# Altium project LimeMM-X8-FMC_1v0.PrjPcb (part 7 of 7)
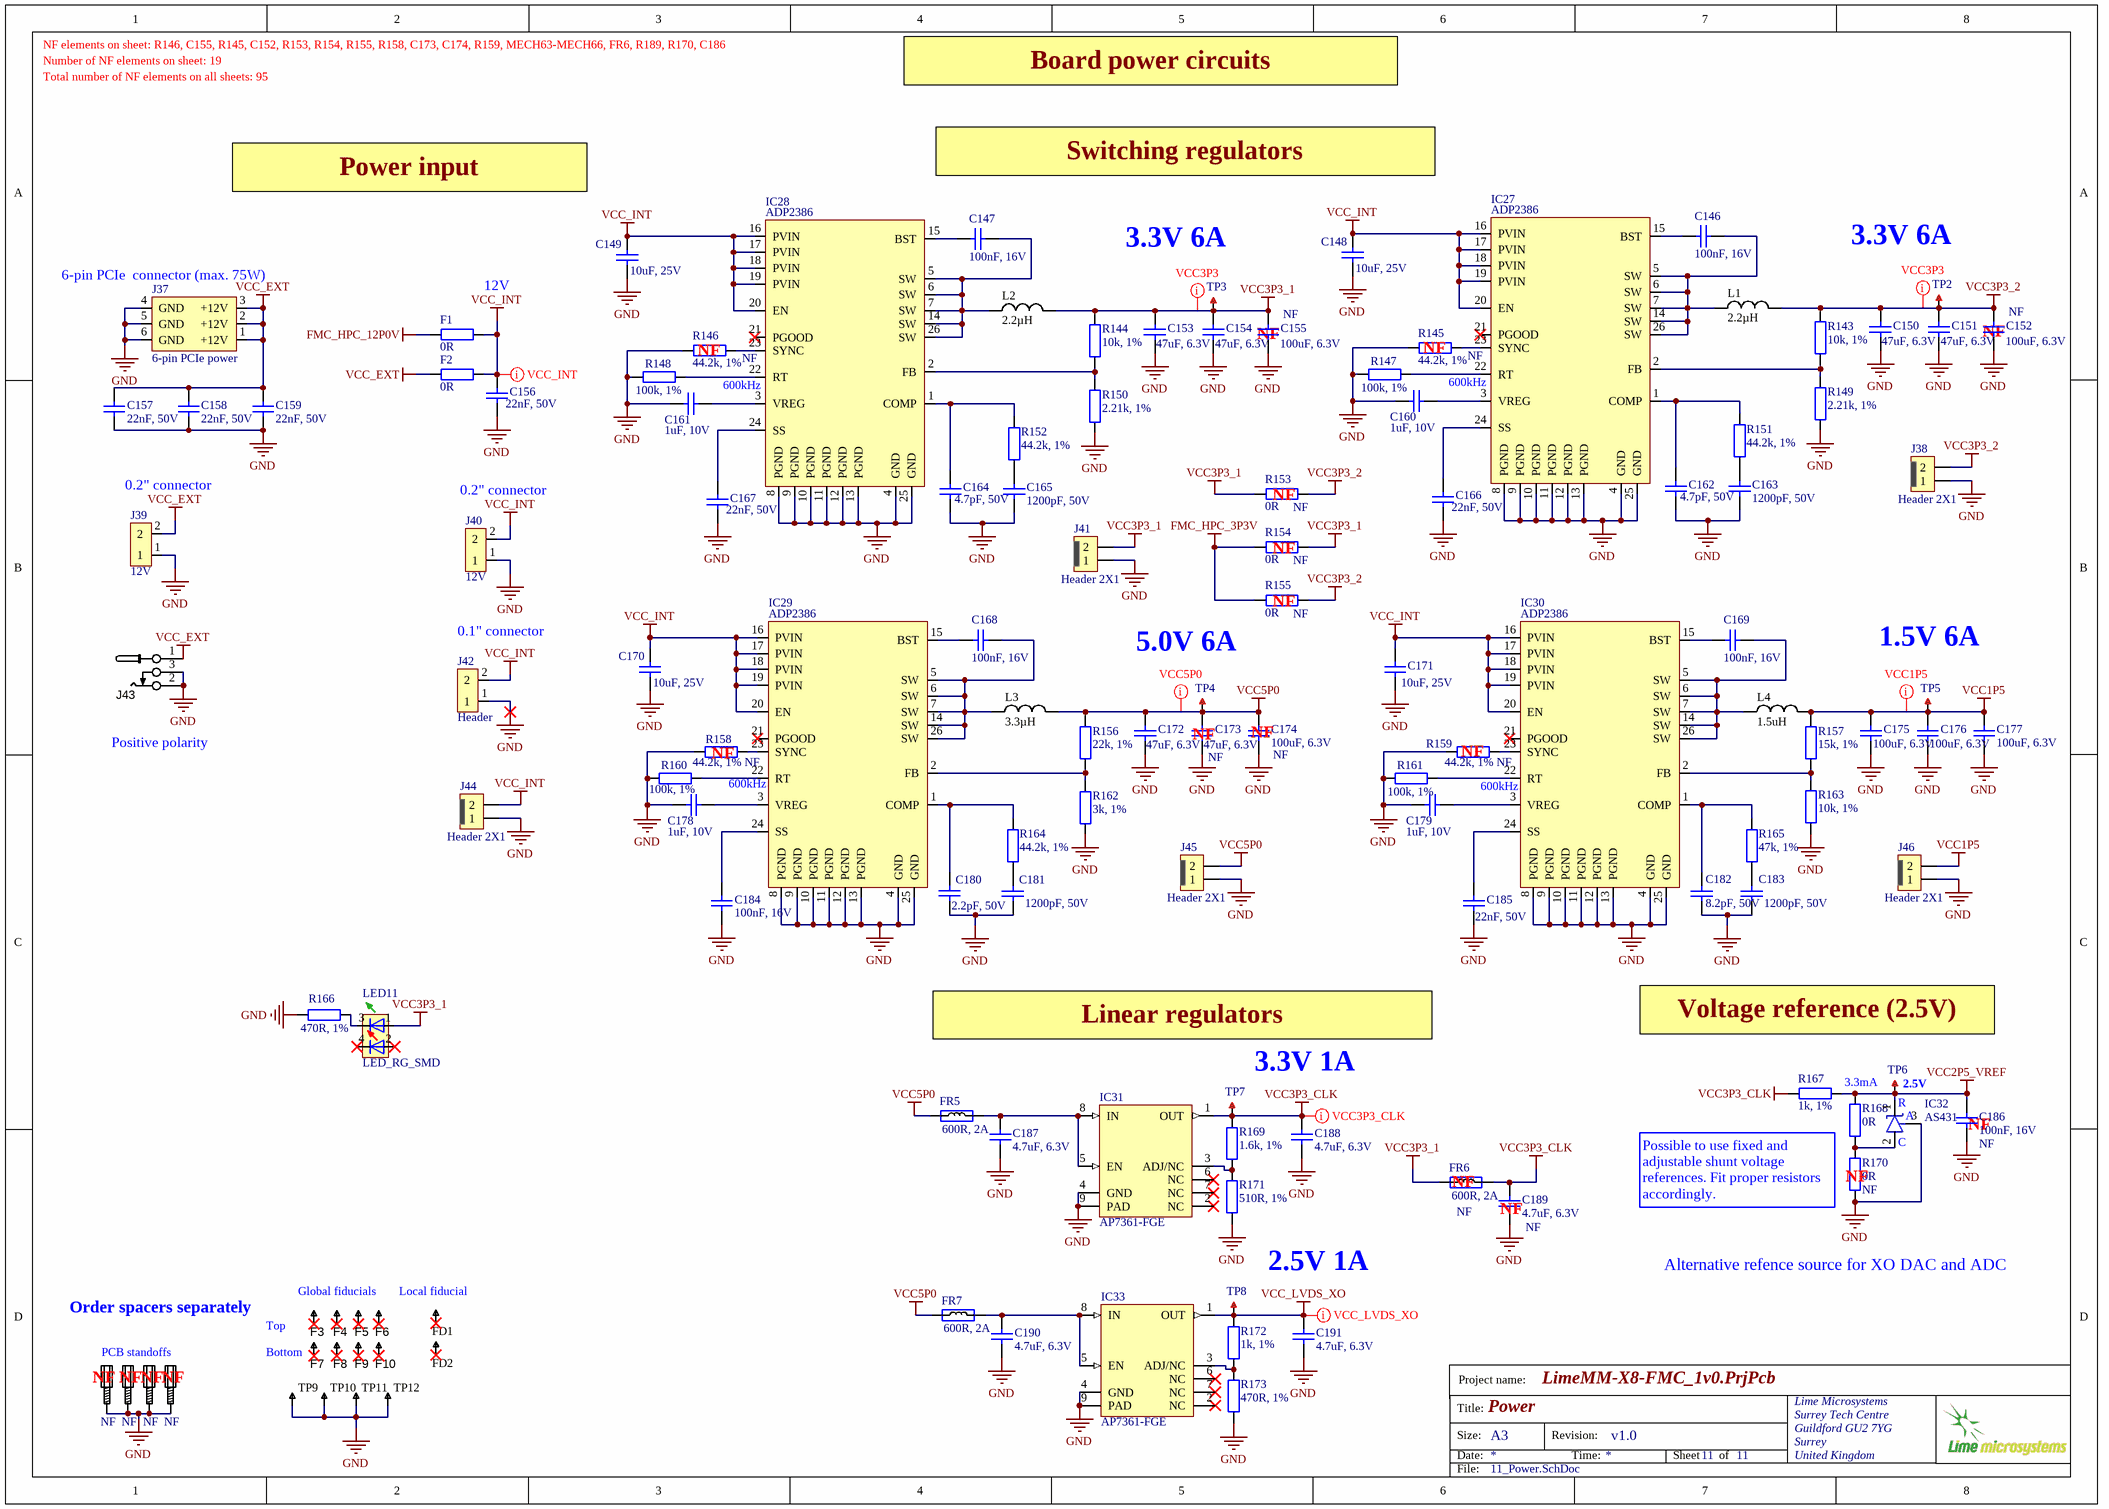
[diagram p12: 11_Power.SchDoc]

## Nets that join several sheets
FMC_HPC_3P3V: 04_FMC_HPC0 (J1.C39 J1.D36 J1.D38 J1.D40), 05_FMC_HPC1 (J2.C39 J2.D36 J2.D38 J2.D40), 11_Power (R154.2 R155.2)
FMC_HPC_3P3VAUX: 04_FMC_HPC0 (5 pins), 05_FMC_HPC1 (6 pins)
FMC_HPC_12P0V: 04_FMC_HPC0 (J1.C35 J1.C37), 05_FMC_HPC1 (J2.C35 J2.C37), 11_Power (F1.2)
FMC_HPC_VADJ: 04_FMC_HPC0 (J1.E39 J1.F40 J1.G39 J1.H40), 05_FMC_HPC1 (J2.E39 J2.F40 J2.G39 J2.H40), 08_Level_conv_misc (38 pins)
GND: 04_FMC_HPC0 (188 pins), 05_FMC_HPC1 (165 pins), 06_mPCIe_1-4 (72 pins), 07_mPCIe_5-8 (72 pins), 08_Level_conv_misc (92 pins), 09_Clock_RF_ref (77 pins), 10_Clock_data_ref (39 pins), 11_Power (116 pins)
VCC1P5: 06_mPCIe_1-4 (12 pins), 07_mPCIe_5-8 (12 pins), 11_Power (7 pins)
VCC2P5_VREF: 09_Clock_RF_ref (R97.2), 11_Power (5 pins)
VCC3P3_1: 04_FMC_HPC0 (26 pins), 06_mPCIe_1-4 (24 pins), 08_Level_conv_misc (46 pins), 11_Power (11 pins)
VCC3P3_2: 07_mPCIe_5-8 (24 pins), 08_Level_conv_misc (R74.1), 11_Power (9 pins)
VCC3P3_CLK: 09_Clock_RF_ref (12 pins), 10_Clock_data_ref (40 pins), 11_Power (7 pins)
VCC5P0: 08_Level_conv_misc (R71.1), 11_Power (9 pins)
VCC_INT: 08_Level_conv_misc (R68.1), 11_Power (30 pins)
VCC_LVDS_XO: 10_Clock_data_ref (R136.2), 11_Power (C191.2 IC33.1 R172.2 TP8.1)
ADF_MUXOUT: 08_Level_conv_misc (IC10.18), 09_Clock_RF_ref (IC21.15 R105.2 R112.1)
ADF_MUXOUT_LS: 04_FMC_HPC0 (J1.H23), 08_Level_conv_misc (IC10.6)
FAN_CTRL_LS: 05_FMC_HPC1 (J2.C18), 08_Level_conv_misc (IC12.3)
FMC_HPC0_CLK_N: 04_FMC_HPC0 (J1.G3), 10_Clock_data_ref (R135.2)
FMC_HPC0_CLK_P: 04_FMC_HPC0 (J1.G2), 10_Clock_data_ref (R131.2)
FMC_HPC0_GBTCLK0_M2C_N: 04_FMC_HPC0 (J1.D5), 10_Clock_data_ref (IC23.21)
FMC_HPC0_GBTCLK0_M2C_P: 04_FMC_HPC0 (J1.D4), 10_Clock_data_ref (IC23.22)
FMC_HPC0_GBTCLK1_M2C_N: 04_FMC_HPC0 (J1.B21), 10_Clock_data_ref (IC23.10)
FMC_HPC0_GBTCLK1_M2C_P: 04_FMC_HPC0 (J1.B20), 10_Clock_data_ref (IC23.11)
FMC_HPC0_LA11_N: 04_FMC_HPC0 (J1.H17), 08_Level_conv_misc (J27.2)
FMC_HPC0_LA15_N: 04_FMC_HPC0 (J1.H20), 08_Level_conv_misc (J27.9)
FMC_HPC0_LA15_P: 04_FMC_HPC0 (J1.H19), 08_Level_conv_misc (J27.10)
FMC_HPC0_LA16_P: 04_FMC_HPC0 (J1.G18), 08_Level_conv_misc (J27.3)
FMC_HPC0_TDI: 04_FMC_HPC0 (J1.D30 R4.2), 06_mPCIe_1-4 (J5.1 R12.2 X1.2)
FMC_HPC0_TDO: 04_FMC_HPC0 (J1.D31 R4.1), 07_mPCIe_5-8 (J24.2 R31.1 X8.1)
FMC_HPC1_GBTCLK0_M2C_N: 05_FMC_HPC1 (J2.D5), 10_Clock_data_ref (IC26.26)
FMC_HPC1_GBTCLK0_M2C_P: 05_FMC_HPC1 (J2.D4), 10_Clock_data_ref (IC26.27)
FMC_HPC1_LA00_CC_N: 05_FMC_HPC1 (J2.G7), 08_Level_conv_misc (J27.5)
FMC_HPC1_LA00_CC_P: 05_FMC_HPC1 (J2.G6), 08_Level_conv_misc (J27.7)
FMC_HPC1_LA02_N: 05_FMC_HPC1 (J2.H8), 08_Level_conv_misc (J27.8)
FMC_HPC1_LA04_N: 05_FMC_HPC1 (J2.H11), 08_Level_conv_misc (J27.4)
FMC_HPC1_LA04_P: 05_FMC_HPC1 (J2.H10), 08_Level_conv_misc (J27.6)
FMC_HPC1_LA11_P: 05_FMC_HPC1 (J2.H16), 08_Level_conv_misc (J27.1)
FPGA_I2C0_SCL: 08_Level_conv_misc (R61.2 VT1.D), 10_Clock_data_ref (IC24.4 XO6.8)
FPGA_I2C0_SCL_LS: 05_FMC_HPC1 (J2.D8), 08_Level_conv_misc (R60.2 VT1.S)
FPGA_I2C0_SDA: 08_Level_conv_misc (R67.2 VT2.D), 10_Clock_data_ref (IC24.5 XO6.7)
FPGA_I2C0_SDA_LS: 05_FMC_HPC1 (J2.G12), 08_Level_conv_misc (R66.2 VT2.S)
FPGA_SPI0_ADF_SS: 08_Level_conv_misc (IC12.19), 09_Clock_RF_ref (R111.1)
FPGA_SPI0_ADF_SS_LS: 05_FMC_HPC1 (J2.D17), 08_Level_conv_misc (IC12.5)
FPGA_SPI0_DAC_SS: 08_Level_conv_misc (IC12.20), 09_Clock_RF_ref (R114.2)
FPGA_SPI0_DAC_SS_LS: 05_FMC_HPC1 (J2.C19), 08_Level_conv_misc (IC12.4)
FPGA_SPI0_MOSI: 08_Level_conv_misc (IC12.18), 09_Clock_RF_ref (R110.1 R116.2)
FPGA_SPI0_MOSI_LS: 05_FMC_HPC1 (J2.D18), 08_Level_conv_misc (IC12.6)
FPGA_SPI0_SCLK: 08_Level_conv_misc (IC12.17), 09_Clock_RF_ref (R108.1 R115.2)
FPGA_SPI0_SCLK_LS: 05_FMC_HPC1 (J2.G16), 08_Level_conv_misc (IC12.7)
PCIE1_CLK_IN: 06_mPCIe_1-4 (J3.19), 09_Clock_RF_ref (IC18.1)
PCIE1_CLK_REQ: 06_mPCIe_1-4 (J3.7), 08_Level_conv_misc (IC9.14 R45.1)
PCIE1_CLK_REQ_LS: 04_FMC_HPC0 (J1.H32), 08_Level_conv_misc (IC9.10)
PCIE1_COEX1: 06_mPCIe_1-4 (J3.3), 08_Level_conv_misc (IC7.20)
PCIE1_COEX1_LS: 04_FMC_HPC0 (J1.G34), 08_Level_conv_misc (IC7.4)
PCIE1_COEX2: 06_mPCIe_1-4 (J3.5), 08_Level_conv_misc (IC9.15)
PCIE1_COEX2_LS: 04_FMC_HPC0 (J1.H31), 08_Level_conv_misc (IC9.9)
PCIE1_LED_WLAN: 06_mPCIe_1-4 (J3.44), 08_Level_conv_misc (IC11.15)
PCIE1_LED_WLAN_LS: 04_FMC_HPC0 (J1.D12), 08_Level_conv_misc (IC11.9)
PCIE1_LED_WPAN: 06_mPCIe_1-4 (J3.46), 08_Level_conv_misc (IC9.20)
PCIE1_LED_WPAN_LS: 04_FMC_HPC0 (J1.C27), 08_Level_conv_misc (IC9.4)
PCIE1_LED_WWAN: 06_mPCIe_1-4 (J3.42), 08_Level_conv_misc (IC11.21)
PCIE1_LED_WWAN_LS: 04_FMC_HPC0 (J1.G12), 08_Level_conv_misc (IC11.3)
PCIE1_PERST: 06_mPCIe_1-4 (J3.22), 08_Level_conv_misc (IC7.18)
PCIE1_PERST_LS: 04_FMC_HPC0 (J1.H35), 08_Level_conv_misc (IC7.6)
PCIE1_REF_CLK_N: 06_mPCIe_1-4 (J3.11), 10_Clock_data_ref (IC23.30)
PCIE1_REF_CLK_P: 06_mPCIe_1-4 (J3.13), 10_Clock_data_ref (IC23.31)
PCIE1_RX0_N: 04_FMC_HPC0 (J1.C3), 06_mPCIe_1-4 (J3.31)
PCIE1_RX0_P: 04_FMC_HPC0 (J1.C2), 06_mPCIe_1-4 (J3.33)
PCIE1_RX1_N: 04_FMC_HPC0 (J1.A23), 06_mPCIe_1-4 (J3.47)
PCIE1_RX1_P: 04_FMC_HPC0 (J1.A22), 06_mPCIe_1-4 (J3.49)
PCIE1_TCK: 04_FMC_HPC0 (IC2.19), 06_mPCIe_1-4 (X1.5)
PCIE1_TMS: 04_FMC_HPC0 (IC4.21), 06_mPCIe_1-4 (X1.3)
PCIE1_TX0_N: 04_FMC_HPC0 (J1.C7), 06_mPCIe_1-4 (C12.1)
PCIE1_TX0_P: 04_FMC_HPC0 (J1.C6), 06_mPCIe_1-4 (C14.1)
PCIE1_TX1_N: 04_FMC_HPC0 (J1.A3), 06_mPCIe_1-4 (C16.1)
PCIE1_TX1_P: 04_FMC_HPC0 (J1.A2), 06_mPCIe_1-4 (C18.1)
PCIE1_UIM8: 06_mPCIe_1-4 (J3.17), 08_Level_conv_misc (IC9.21)
PCIE1_UIM8_LS: 04_FMC_HPC0 (J1.C26), 08_Level_conv_misc (IC9.3)
PCIE1_W_DISABLE: 06_mPCIe_1-4 (J3.20), 08_Level_conv_misc (IC7.19)
PCIE1_W_DISABLE_LS: 04_FMC_HPC0 (J1.H34), 08_Level_conv_misc (IC7.5)
PCIE2_CLK_IN: 06_mPCIe_1-4 (J4.19), 09_Clock_RF_ref (IC18.3)
PCIE2_CLK_REQ: 06_mPCIe_1-4 (J4.7), 08_Level_conv_misc (IC9.18 R46.1)
PCIE2_CLK_REQ_LS: 04_FMC_HPC0 (J1.D27), 08_Level_conv_misc (IC9.6)
PCIE2_COEX1: 06_mPCIe_1-4 (J4.3), 08_Level_conv_misc (IC11.18)
PCIE2_COEX1_LS: 04_FMC_HPC0 (J1.C11), 08_Level_conv_misc (IC11.6)
PCIE2_COEX2: 06_mPCIe_1-4 (J4.5), 08_Level_conv_misc (IC9.19)
PCIE2_COEX2_LS: 04_FMC_HPC0 (J1.D26), 08_Level_conv_misc (IC9.5)
PCIE2_LED_WLAN: 06_mPCIe_1-4 (J4.44), 08_Level_conv_misc (IC11.20)
PCIE2_LED_WLAN_LS: 04_FMC_HPC0 (J1.G13), 08_Level_conv_misc (IC11.4)
PCIE2_LED_WPAN: 06_mPCIe_1-4 (J4.46), 08_Level_conv_misc (IC9.16)
PCIE2_LED_WPAN_LS: 04_FMC_HPC0 (J1.G28), 08_Level_conv_misc (IC9.8)
PCIE2_LED_WWAN: 06_mPCIe_1-4 (J4.42), 08_Level_conv_misc (IC11.17)
PCIE2_LED_WWAN_LS: 04_FMC_HPC0 (J1.D11), 08_Level_conv_misc (IC11.7)
PCIE2_PERST: 06_mPCIe_1-4 (J4.22), 08_Level_conv_misc (IC11.16)
PCIE2_PERST_LS: 04_FMC_HPC0 (J1.H14), 08_Level_conv_misc (IC11.8)
PCIE2_REF_CLK_N: 06_mPCIe_1-4 (J4.11), 10_Clock_data_ref (IC23.28)
PCIE2_REF_CLK_P: 06_mPCIe_1-4 (J4.13), 10_Clock_data_ref (IC23.29)
PCIE2_RX0_N: 04_FMC_HPC0 (J1.A27), 06_mPCIe_1-4 (J4.31)
PCIE2_RX0_P: 04_FMC_HPC0 (J1.A26), 06_mPCIe_1-4 (J4.33)
PCIE2_TCK: 04_FMC_HPC0 (IC2.20), 06_mPCIe_1-4 (X2.5)
PCIE2_TMS: 04_FMC_HPC0 (IC4.20), 06_mPCIe_1-4 (X2.3)
PCIE2_TX0_N: 04_FMC_HPC0 (J1.A7), 06_mPCIe_1-4 (C13.1)
PCIE2_TX0_P: 04_FMC_HPC0 (J1.A6), 06_mPCIe_1-4 (C15.1)
PCIE2_UIM8: 06_mPCIe_1-4 (J4.17), 08_Level_conv_misc (IC9.17)
PCIE2_UIM8_LS: 04_FMC_HPC0 (J1.G27), 08_Level_conv_misc (IC9.7)
PCIE2_W_DISABLE: 06_mPCIe_1-4 (J4.20), 08_Level_conv_misc (IC11.19)
PCIE2_W_DISABLE_LS: 04_FMC_HPC0 (J1.C10), 08_Level_conv_misc (IC11.5)
PCIE3_CLK_IN: 06_mPCIe_1-4 (J9.19), 09_Clock_RF_ref (IC18.5)
PCIE3_CLK_REQ: 06_mPCIe_1-4 (J9.7), 08_Level_conv_misc (IC13.14 R54.1)
PCIE3_CLK_REQ_LS: 04_FMC_HPC0 (J1.H29), 08_Level_conv_misc (IC13.10)
PCIE3_COEX1: 06_mPCIe_1-4 (J9.3), 08_Level_conv_misc (IC11.14)
PCIE3_COEX1_LS: 04_FMC_HPC0 (J1.D15), 08_Level_conv_misc (IC11.10)
PCIE3_COEX2: 06_mPCIe_1-4 (J9.5), 08_Level_conv_misc (IC13.15)
PCIE3_COEX2_LS: 04_FMC_HPC0 (J1.H28), 08_Level_conv_misc (IC13.9)
PCIE3_LED_WLAN: 06_mPCIe_1-4 (J9.44), 08_Level_conv_misc (IC14.15)
PCIE3_LED_WLAN_LS: 04_FMC_HPC0 (J1.D20), 08_Level_conv_misc (IC14.9)
PCIE3_LED_WPAN: 06_mPCIe_1-4 (J9.46), 08_Level_conv_misc (IC13.17)
PCIE3_LED_WPAN_LS: 04_FMC_HPC0 (J1.D24), 08_Level_conv_misc (IC13.7)
PCIE3_LED_WWAN: 06_mPCIe_1-4 (J9.42), 08_Level_conv_misc (IC14.19)
PCIE3_LED_WWAN_LS: 04_FMC_HPC0 (J1.C14), 08_Level_conv_misc (IC14.5)
PCIE3_PERST: 06_mPCIe_1-4 (J9.22), 08_Level_conv_misc (IC14.18)
PCIE3_PERST_LS: 04_FMC_HPC0 (J1.C15), 08_Level_conv_misc (IC14.6)
PCIE3_REF_CLK_N: 06_mPCIe_1-4 (J9.11), 10_Clock_data_ref (IC23.26)
PCIE3_REF_CLK_P: 06_mPCIe_1-4 (J9.13), 10_Clock_data_ref (IC23.27)
PCIE3_RX0_N: 04_FMC_HPC0 (J1.A31), 06_mPCIe_1-4 (J9.31)
PCIE3_RX0_P: 04_FMC_HPC0 (J1.A30), 06_mPCIe_1-4 (J9.33)
PCIE3_TCK: 04_FMC_HPC0 (IC2.21), 06_mPCIe_1-4 (X3.5)
PCIE3_TMS: 04_FMC_HPC0 (IC4.19), 06_mPCIe_1-4 (X3.3)
PCIE3_TX0_N: 04_FMC_HPC0 (J1.A11), 06_mPCIe_1-4 (C20.1)
PCIE3_TX0_P: 04_FMC_HPC0 (J1.A10), 06_mPCIe_1-4 (C22.1)
PCIE3_UIM8: 06_mPCIe_1-4 (J9.17), 08_Level_conv_misc (IC13.19)
PCIE3_UIM8_LS: 04_FMC_HPC0 (J1.D23), 08_Level_conv_misc (IC13.5)
PCIE3_W_DISABLE: 06_mPCIe_1-4 (J9.20), 08_Level_conv_misc (IC14.21)
PCIE3_W_DISABLE_LS: 04_FMC_HPC0 (J1.D14), 08_Level_conv_misc (IC14.3)
PCIE4_CLK_IN: 06_mPCIe_1-4 (J10.19), 09_Clock_RF_ref (IC18.7)
PCIE4_CLK_REQ: 06_mPCIe_1-4 (J10.7), 08_Level_conv_misc (IC13.16 R55.1)
PCIE4_CLK_REQ_LS: 04_FMC_HPC0 (J1.G25), 08_Level_conv_misc (IC13.8)
PCIE4_COEX1: 06_mPCIe_1-4 (J10.3), 08_Level_conv_misc (IC14.17)
PCIE4_COEX1_LS: 04_FMC_HPC0 (J1.G16), 08_Level_conv_misc (IC14.7)
PCIE4_COEX2: 06_mPCIe_1-4 (J10.5), 08_Level_conv_misc (IC13.18)
PCIE4_COEX2_LS: 04_FMC_HPC0 (J1.G24), 08_Level_conv_misc (IC13.6)
PCIE4_LED_WLAN: 06_mPCIe_1-4 (J10.44), 08_Level_conv_misc (IC8.21)
PCIE4_LED_WLAN_LS: 05_FMC_HPC1 (J2.H7), 08_Level_conv_misc (IC8.3)
PCIE4_LED_WPAN: 06_mPCIe_1-4 (J10.46), 08_Level_conv_misc (IC13.20)
PCIE4_LED_WPAN_LS: 04_FMC_HPC0 (J1.H26), 08_Level_conv_misc (IC13.4)
PCIE4_LED_WWAN: 06_mPCIe_1-4 (J10.42), 08_Level_conv_misc (IC14.16)
PCIE4_LED_WWAN_LS: 04_FMC_HPC0 (J1.D17), 08_Level_conv_misc (IC14.8)
PCIE4_PERST: 06_mPCIe_1-4 (J10.22), 08_Level_conv_misc (IC14.14)
PCIE4_PERST_LS: 04_FMC_HPC0 (J1.D21), 08_Level_conv_misc (IC14.10)
PCIE4_REF_CLK_N: 06_mPCIe_1-4 (J10.11), 10_Clock_data_ref (IC23.23)
PCIE4_REF_CLK_P: 06_mPCIe_1-4 (J10.13), 10_Clock_data_ref (IC23.24)
PCIE4_RX0_N: 04_FMC_HPC0 (J1.A35), 06_mPCIe_1-4 (J10.31)
PCIE4_RX0_P: 04_FMC_HPC0 (J1.A34), 06_mPCIe_1-4 (J10.33)
PCIE4_TCK: 04_FMC_HPC0 (IC2.18), 06_mPCIe_1-4 (X4.5)
PCIE4_TDO_PCIE5_TDI: 06_mPCIe_1-4 (J12.2 R19.1 X4.1), 07_mPCIe_5-8 (J17.1 R24.2 X5.2)
PCIE4_TMS: 04_FMC_HPC0 (IC4.18), 06_mPCIe_1-4 (X4.3)
PCIE4_TX0_N: 04_FMC_HPC0 (J1.A15), 06_mPCIe_1-4 (C21.1)
PCIE4_TX0_P: 04_FMC_HPC0 (J1.A14), 06_mPCIe_1-4 (C23.1)
PCIE4_UIM8: 06_mPCIe_1-4 (J10.17), 08_Level_conv_misc (IC13.21)
PCIE4_UIM8_LS: 04_FMC_HPC0 (J1.H25), 08_Level_conv_misc (IC13.3)
PCIE4_W_DISABLE: 06_mPCIe_1-4 (J10.20), 08_Level_conv_misc (IC14.20)
PCIE4_W_DISABLE_LS: 04_FMC_HPC0 (J1.G15), 08_Level_conv_misc (IC14.4)
PCIE5_CLK_IN: 07_mPCIe_5-8 (J15.19), 09_Clock_RF_ref (IC18.8)
PCIE5_CLK_REQ: 07_mPCIe_5-8 (J15.7), 08_Level_conv_misc (IC15.14 R56.1)
PCIE5_CLK_REQ_LS: 04_FMC_HPC0 (J1.D9), 08_Level_conv_misc (IC15.10)
PCIE5_COEX1: 07_mPCIe_5-8 (J15.3), 08_Level_conv_misc (IC7.17)
PCIE5_COEX1_LS: 04_FMC_HPC0 (J1.G36), 08_Level_conv_misc (IC7.7)
PCIE5_COEX2: 07_mPCIe_5-8 (J15.5), 08_Level_conv_misc (IC15.19)
PCIE5_COEX2_LS: 04_FMC_HPC0 (J1.G9), 08_Level_conv_misc (IC15.5)
PCIE5_LED_WLAN: 07_mPCIe_5-8 (J15.44), 08_Level_conv_misc (IC7.21)
PCIE5_LED_WLAN_LS: 04_FMC_HPC0 (J1.G33), 08_Level_conv_misc (IC7.3)
PCIE5_LED_WPAN: 07_mPCIe_5-8 (J15.46), 08_Level_conv_misc (IC15.20)
PCIE5_LED_WPAN_LS: 04_FMC_HPC0 (J1.G7), 08_Level_conv_misc (IC15.4)
PCIE5_LED_WWAN: 07_mPCIe_5-8 (J15.42), 08_Level_conv_misc (IC7.14)
PCIE5_LED_WWAN_LS: 04_FMC_HPC0 (J1.H38), 08_Level_conv_misc (IC7.10)
PCIE5_PERST: 07_mPCIe_5-8 (J15.22), 08_Level_conv_misc (IC7.15)
PCIE5_PERST_LS: 04_FMC_HPC0 (J1.H37), 08_Level_conv_misc (IC7.9)
PCIE5_REF_CLK_N: 07_mPCIe_5-8 (J15.11), 10_Clock_data_ref (IC23.14)
PCIE5_REF_CLK_P: 07_mPCIe_5-8 (J15.13), 10_Clock_data_ref (IC23.15)
PCIE5_RX0_N: 04_FMC_HPC0 (J1.A39), 07_mPCIe_5-8 (J15.31)
PCIE5_RX0_P: 04_FMC_HPC0 (J1.A38), 07_mPCIe_5-8 (J15.33)
PCIE5_TCK: 04_FMC_HPC0 (IC2.17), 07_mPCIe_5-8 (X5.5)
PCIE5_TMS: 04_FMC_HPC0 (IC4.17), 07_mPCIe_5-8 (X5.3)
PCIE5_TX0_N: 04_FMC_HPC0 (J1.A19), 07_mPCIe_5-8 (C28.1)
PCIE5_TX0_P: 04_FMC_HPC0 (J1.A18), 07_mPCIe_5-8 (C30.1)
PCIE5_UIM8: 07_mPCIe_5-8 (J15.17), 08_Level_conv_misc (IC15.15)
PCIE5_UIM8_LS: 04_FMC_HPC0 (J1.D8), 08_Level_conv_misc (IC15.9)
PCIE5_W_DISABLE: 07_mPCIe_5-8 (J15.20), 08_Level_conv_misc (IC7.16)
PCIE5_W_DISABLE_LS: 04_FMC_HPC0 (J1.G37), 08_Level_conv_misc (IC7.8)
PCIE6_CLK_IN: 07_mPCIe_5-8 (J16.19), 09_Clock_RF_ref (IC18.17)
PCIE6_CLK_REQ: 07_mPCIe_5-8 (J16.7), 08_Level_conv_misc (IC15.18 R57.1)
PCIE6_CLK_REQ_LS: 04_FMC_HPC0 (J1.G10), 08_Level_conv_misc (IC15.6)
PCIE6_COEX1: 07_mPCIe_5-8 (J16.3), 08_Level_conv_misc (IC8.17)
PCIE6_COEX1_LS: 05_FMC_HPC1 (J2.G10), 08_Level_conv_misc (IC8.7)
PCIE6_COEX2: 07_mPCIe_5-8 (J16.5), 08_Level_conv_misc (IC15.21)
PCIE6_COEX2_LS: 04_FMC_HPC0 (J1.G6), 08_Level_conv_misc (IC15.3)
PCIE6_LED_WLAN: 07_mPCIe_5-8 (J16.44), 08_Level_conv_misc (IC8.14)
PCIE6_LED_WLAN_LS: 05_FMC_HPC1 (J2.D12), 08_Level_conv_misc (IC8.10)
PCIE6_LED_WPAN: 07_mPCIe_5-8 (J16.46), 08_Level_conv_misc (IC15.16)
PCIE6_LED_WPAN_LS: 04_FMC_HPC0 (J1.H13), 08_Level_conv_misc (IC15.8)
PCIE6_LED_WWAN: 07_mPCIe_5-8 (J16.42), 08_Level_conv_misc (IC8.19)
PCIE6_LED_WWAN_LS: 05_FMC_HPC1 (J2.D9), 08_Level_conv_misc (IC8.5)
PCIE6_PERST: 07_mPCIe_5-8 (J16.22), 08_Level_conv_misc (IC8.15)
PCIE6_PERST_LS: 05_FMC_HPC1 (J2.D11), 08_Level_conv_misc (IC8.9)
PCIE6_REF_CLK_N: 07_mPCIe_5-8 (J16.11), 10_Clock_data_ref (IC23.17)
PCIE6_REF_CLK_P: 07_mPCIe_5-8 (J16.13), 10_Clock_data_ref (IC23.18)
PCIE6_RX0_N: 04_FMC_HPC0 (J1.B37), 07_mPCIe_5-8 (J16.31)
PCIE6_RX0_P: 04_FMC_HPC0 (J1.B36), 07_mPCIe_5-8 (J16.33)
PCIE6_TCK: 04_FMC_HPC0 (IC2.16), 07_mPCIe_5-8 (X6.5)
PCIE6_TMS: 04_FMC_HPC0 (IC4.16), 07_mPCIe_5-8 (X6.3)
PCIE6_TX0_N: 04_FMC_HPC0 (J1.B17), 07_mPCIe_5-8 (C29.1)
PCIE6_TX0_P: 04_FMC_HPC0 (J1.B16), 07_mPCIe_5-8 (C31.1)
PCIE6_UIM8: 07_mPCIe_5-8 (J16.17), 08_Level_conv_misc (IC15.17)
PCIE6_UIM8_LS: 04_FMC_HPC0 (J1.H11), 08_Level_conv_misc (IC15.7)
PCIE6_W_DISABLE: 07_mPCIe_5-8 (J16.20), 08_Level_conv_misc (IC8.20)
PCIE6_W_DISABLE_LS: 05_FMC_HPC1 (J2.G9), 08_Level_conv_misc (IC8.4)
PCIE7_CLK_IN: 07_mPCIe_5-8 (J21.19), 09_Clock_RF_ref (IC18.18)
PCIE7_CLK_REQ: 07_mPCIe_5-8 (J21.7), 08_Level_conv_misc (IC17.15 R58.1)
PCIE7_CLK_REQ_LS: 04_FMC_HPC0 (J1.H7), 08_Level_conv_misc (IC17.9)
PCIE7_COEX1: 07_mPCIe_5-8 (J21.3), 08_Level_conv_misc (IC8.16)
PCIE7_COEX1_LS: 05_FMC_HPC1 (J2.C11), 08_Level_conv_misc (IC8.8)
PCIE7_COEX2: 07_mPCIe_5-8 (J21.5), 08_Level_conv_misc (IC17.16)
PCIE7_COEX2_LS: 04_FMC_HPC0 (J1.H8), 08_Level_conv_misc (IC17.8)
PCIE7_LED_WLAN: 07_mPCIe_5-8 (J21.44), 08_Level_conv_misc (IC16.21)
PCIE7_LED_WLAN_LS: 05_FMC_HPC1 (J2.G13), 08_Level_conv_misc (IC16.3)
PCIE7_LED_WPAN: 07_mPCIe_5-8 (J21.46), 08_Level_conv_misc (IC17.17)
PCIE7_LED_WPAN_LS: 04_FMC_HPC0 (J1.H16), 08_Level_conv_misc (IC17.7)
PCIE7_LED_WWAN: 07_mPCIe_5-8 (J21.42), 08_Level_conv_misc (IC16.17)
PCIE7_LED_WWAN_LS: 05_FMC_HPC1 (J2.H13), 08_Level_conv_misc (IC16.7)
PCIE7_PERST: 07_mPCIe_5-8 (J21.22), 08_Level_conv_misc (IC16.14)
PCIE7_PERST_LS: 05_FMC_HPC1 (J2.H14), 08_Level_conv_misc (IC16.10)
PCIE7_REF_CLK_N: 07_mPCIe_5-8 (J21.11), 10_Clock_data_ref (IC23.19)
PCIE7_REF_CLK_P: 07_mPCIe_5-8 (J21.13), 10_Clock_data_ref (IC23.20)
PCIE7_RX0_N: 04_FMC_HPC0 (J1.B33), 07_mPCIe_5-8 (J21.31)
PCIE7_RX0_P: 04_FMC_HPC0 (J1.B32), 07_mPCIe_5-8 (J21.33)
PCIE7_TCK: 04_FMC_HPC0 (IC2.15), 07_mPCIe_5-8 (X7.5)
PCIE7_TMS: 04_FMC_HPC0 (IC4.15), 07_mPCIe_5-8 (X7.3)
PCIE7_TX0_N: 04_FMC_HPC0 (J1.B13), 07_mPCIe_5-8 (C36.1)
PCIE7_TX0_P: 04_FMC_HPC0 (J1.B12), 07_mPCIe_5-8 (C38.1)
PCIE7_UIM8: 07_mPCIe_5-8 (J21.17), 08_Level_conv_misc (IC17.14)
PCIE7_UIM8_LS: 04_FMC_HPC0 (J1.H10), 08_Level_conv_misc (IC17.10)
PCIE7_W_DISABLE: 07_mPCIe_5-8 (J21.20), 08_Level_conv_misc (IC8.18)
PCIE7_W_DISABLE_LS: 05_FMC_HPC1 (J2.C10), 08_Level_conv_misc (IC8.6)
PCIE8_CLK_IN: 07_mPCIe_5-8 (J22.19), 09_Clock_RF_ref (IC18.20)
PCIE8_CLK_REQ: 07_mPCIe_5-8 (J22.7), 08_Level_conv_misc (IC17.18 R59.1)
PCIE8_CLK_REQ_LS: 05_FMC_HPC1 (J2.H19), 08_Level_conv_misc (IC17.6)
PCIE8_COEX1: 07_mPCIe_5-8 (J22.3), 08_Level_conv_misc (IC16.16)
PCIE8_COEX1_LS: 05_FMC_HPC1 (J2.D15), 08_Level_conv_misc (IC16.8)
PCIE8_COEX2: 07_mPCIe_5-8 (J22.5), 08_Level_conv_misc (IC17.19)
PCIE8_COEX2_LS: 05_FMC_HPC1 (J2.H20), 08_Level_conv_misc (IC17.5)
PCIE8_LED_WLAN: 07_mPCIe_5-8 (J22.44), 08_Level_conv_misc (IC12.16)
PCIE8_LED_WLAN_LS: 05_FMC_HPC1 (J2.H17), 08_Level_conv_misc (IC12.8)
PCIE8_LED_WPAN: 07_mPCIe_5-8 (J22.46), 08_Level_conv_misc (IC17.20)
PCIE8_LED_WPAN_LS: 05_FMC_HPC1 (J2.G18), 08_Level_conv_misc (IC17.4)
PCIE8_LED_WWAN: 07_mPCIe_5-8 (J22.42), 08_Level_conv_misc (IC16.20)
PCIE8_LED_WWAN_LS: 05_FMC_HPC1 (J2.C14), 08_Level_conv_misc (IC16.4)
PCIE8_PERST: 07_mPCIe_5-8 (J22.22), 08_Level_conv_misc (IC16.18)
PCIE8_PERST_LS: 05_FMC_HPC1 (J2.C15), 08_Level_conv_misc (IC16.6)
PCIE8_REF_CLK_N: 07_mPCIe_5-8 (J22.11), 10_Clock_data_ref (IC26.30)
PCIE8_REF_CLK_P: 07_mPCIe_5-8 (J22.13), 10_Clock_data_ref (IC26.31)
PCIE8_RX0_N: 05_FMC_HPC1 (J2.C3), 07_mPCIe_5-8 (J22.31)
PCIE8_RX0_P: 05_FMC_HPC1 (J2.C2), 07_mPCIe_5-8 (J22.33)
PCIE8_TCK: 04_FMC_HPC0 (IC2.14), 07_mPCIe_5-8 (X8.5)
PCIE8_TMS: 04_FMC_HPC0 (IC4.14), 07_mPCIe_5-8 (X8.3)
PCIE8_TX0_N: 05_FMC_HPC1 (J2.C7), 07_mPCIe_5-8 (C37.1)
PCIE8_TX0_P: 05_FMC_HPC1 (J2.C6), 07_mPCIe_5-8 (C39.1)
PCIE8_UIM8: 07_mPCIe_5-8 (J22.17), 08_Level_conv_misc (IC17.21)
PCIE8_UIM8_LS: 05_FMC_HPC1 (J2.G19), 08_Level_conv_misc (IC17.3)
PCIE8_W_DISABLE: 07_mPCIe_5-8 (J22.20), 08_Level_conv_misc (IC16.19)
PCIE8_W_DISABLE_LS: 05_FMC_HPC1 (J2.D14), 08_Level_conv_misc (IC16.5)
PCIE_SMB_CLK: 06_mPCIe_1-4 (J3.30 J4.30 J9.30 J10.30), 07_mPCIe_5-8 (J15.30 J16.30 J21.30 J22.30), 08_Level_conv_misc (IC10.17)
PCIE_SMB_CLK_LS: 04_FMC_HPC0 (J1.G30), 08_Level_conv_misc (IC10.7)
PCIE_SMB_DATA: 06_mPCIe_1-4 (J3.32 J4.32 J9.32 J10.32), 07_mPCIe_5-8 (J15.32 J16.32 J21.32 J22.32), 08_Level_conv_misc (IC16.15)
PCIE_SMB_DATA_LS: 05_FMC_HPC1 (J2.G15), 08_Level_conv_misc (IC16.9)
STATUS_LED_G_LS: 04_FMC_HPC0 (J1.C19), 08_Level_conv_misc (IC12.9)
STATUS_LED_R_LS: 04_FMC_HPC0 (J1.C18), 08_Level_conv_misc (IC12.10)